# Altium schematic sheet [01] - LED DRIVER.SchDoc
size A
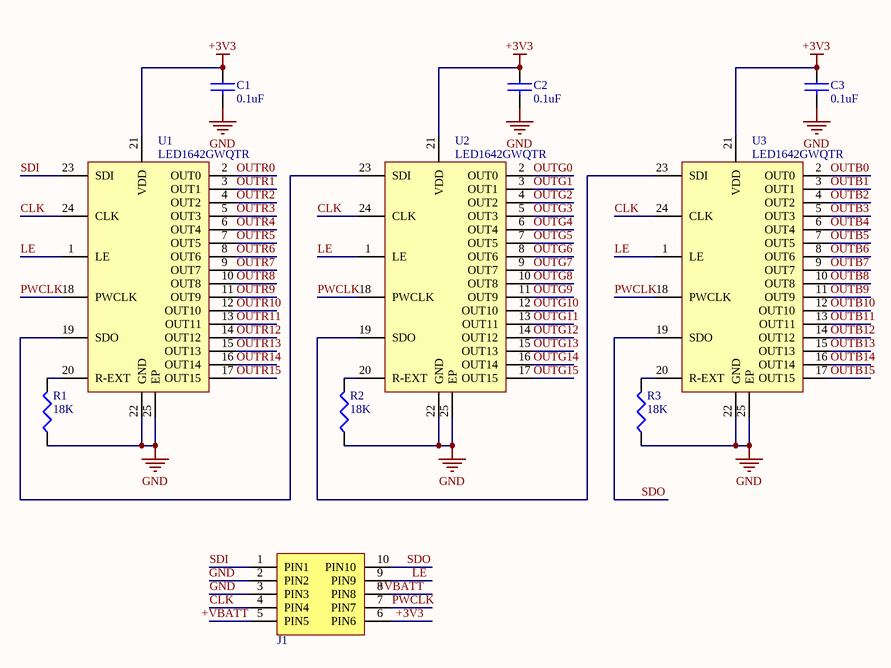
[diagram p0: [01] - LED DRIVER.SchDoc]

## Parts
C1  0.1uF  [C0402]
C2  0.1uF  [C0402]
C3  0.1uF  [C0402]
J1  20021121-00010C4LF  [20021121-00010C4LF]  (value not drawn)
R1  18K  [R0402]
R2  18K  [R0402]
R3  18K  [R0402]
U1  LED1642GWQTR  [QFN24]
U2  LED1642GWQTR  [QFN24]
U3  LED1642GWQTR  [QFN24]

## Nets
+3V3: C1.1 C2.1 C3.1 J1.6(PIN6) U1.21(VDD) U2.21(VDD) U3.21(VDD)
GND: C1.2 C2.2 C3.2 J1.2(PIN2) J1.3(PIN3) R1.1 R2.1 R3.1 U1.22(GND) U1.25(EP) U2.22(GND) U2.25(EP) U3.22(GND) U3.25(EP)
+VBATT: J1.5(PIN5) J1.8(PIN8)
CLK: J1.4(PIN4) U1.24(CLK) U2.24(CLK) U3.24(CLK)
LE: J1.9(PIN9) U1.1(LE) U2.1(LE) U3.1(LE)
OUTB0: U3.2(OUT0)
OUTB1: U3.3(OUT1)
OUTB2: U3.4(OUT2)
OUTB3: U3.5(OUT3)
OUTB4: U3.6(OUT4)
OUTB5: U3.7(OUT5)
OUTB6: U3.8(OUT6)
OUTB7: U3.9(OUT7)
OUTB8: U3.10(OUT8)
OUTB9: U3.11(OUT9)
OUTB10: U3.12(OUT10)
OUTB11: U3.13(OUT11)
OUTB12: U3.14(OUT12)
OUTB13: U3.15(OUT13)
OUTB14: U3.16(OUT14)
OUTB15: U3.17(OUT15)
OUTG0: U2.2(OUT0)
OUTG1: U2.3(OUT1)
OUTG2: U2.4(OUT2)
OUTG3: U2.5(OUT3)
OUTG4: U2.6(OUT4)
OUTG5: U2.7(OUT5)
OUTG6: U2.8(OUT6)
OUTG7: U2.9(OUT7)
OUTG8: U2.10(OUT8)
OUTG9: U2.11(OUT9)
OUTG10: U2.12(OUT10)
OUTG11: U2.13(OUT11)
OUTG12: U2.14(OUT12)
OUTG13: U2.15(OUT13)
OUTG14: U2.16(OUT14)
OUTG15: U2.17(OUT15)
OUTR0: U1.2(OUT0)
OUTR1: U1.3(OUT1)
OUTR2: U1.4(OUT2)
OUTR3: U1.5(OUT3)
OUTR4: U1.6(OUT4)
OUTR5: U1.7(OUT5)
OUTR6: U1.8(OUT6)
OUTR7: U1.9(OUT7)
OUTR8: U1.10(OUT8)
OUTR9: U1.11(OUT9)
OUTR10: U1.12(OUT10)
OUTR11: U1.13(OUT11)
OUTR12: U1.14(OUT12)
OUTR13: U1.15(OUT13)
OUTR14: U1.16(OUT14)
OUTR15: U1.17(OUT15)
PWCLK: J1.7(PIN7) U1.18(PWCLK) U2.18(PWCLK) U3.18(PWCLK)
SDI: J1.1(PIN1) U1.23(SDI)
SDO: J1.10(PIN10) U3.19(SDO)
NetR1_2: R1.2 U1.20(R-EXT)
NetR2_2: R2.2 U2.20(R-EXT)
NetR3_2: R3.2 U3.20(R-EXT)
NetU1_19: U1.19(SDO) U2.23(SDI)
NetU2_19: U2.19(SDO) U3.23(SDI)

## Library data of the parts
C1-C3 = CL05B104KO5NNNC: Cap Ceramic 0.1uF 16V X7R 10% SMD 0402 125C C/T; Manufacturer 1: Samsung; Description 1: Cap Ceramic 0.1uF 16V X7R 10% SMD 0402 125C Paper T/R; Capacitance: 100nF; Supplier 1: Digi-Key; Supplier Part Number 1: 1276-1001-6-ND; Manufacturer Part Number 1: CL05B104KO5NNNC; Stock 1: 9531; Pricing 1: 1=0.1, 10=0.018, 100=0.0081, 500=0.0058, 1000=0.0045, 2500=0.0041, 5000=0.0038 (USD); Mount: Surface Mount; Case/Package: 0402; Case Code (Metric): 1005; Case Code (Imperial): 0402; Material: Ceramic; Contact Plating: Tin; Min Operating Temperature: -55°C; Max Operating Temperature: 125°C; Tolerance: 10%; Package Quantity: 1; Packaging: Tape and Reel; Voltage Rating: 16V; Dielectric: X7R; Voltage: 16V; Voltage Rating (DC): 16V; Length: 1mm; Height: 0.5mm; Width: 0.02inch; Thickness: 0.022inch; Depth: 0.5mm; Radiation Hardening: No; Lead Free: Lead Free; ComponentLink1URL: https://datasheet.ciiva.com/16208/cl05b104kq5nnnc-16208343.pdf; ComponentLink1Description: https://datasheet.ciiva.com/16208/cl05b104kq5nnnc-16208343.pdf; ComponentLink2URL: https://datasheet.ciiva.com/26920/getdatasheetpartid-359683-26920169.pdf; ComponentLink2Description: https://datasheet.ciiva.com/26920/getdatasheetpartid-359683-26920169.pdf; ComponentLink3URL: https://datasheet.ciiva.com/26309/mlcc-catalogdownload2013-eng-26309003.pdf; ComponentLink3Description: https://datasheet.ciiva.com/26309/mlcc-catalogdownload2013-eng-26309003.pdf; ComponentLink4URL: https://datasheet.ciiva.com/29198/458718-da-01-en-vs-kondensator-0402-29198423.pdf; ComponentLink4Description: https://datasheet.ciiva.com/29198/458718-da-01-en-vs-kondensator-0402-29198423.pdf
J1 = 20021121-00010C4LF: CONN HEADER SMD 10POS 1.27MM; Manufacturer: Amphenol FCI; Number of Contacts: 10; Contact Resistance: 30mR; Current Rating: 1A; Voltage Rating: 125V; Insulation Resistance: 100MR; Gender: Male; Connector Type: Male Pin,Header; Row Spacing: 0.05inch; Stack Height: 3mm; Supplier 1: Digi-Key; Supplier Part Number 1: 609-3695-1-ND; Manufacturer Part Number: 20021121-00010C4LF; Stock 1: 79305; Pricing 1: 1=0.84, 10=0.739, 100=0.6372 (USD); Mount: Surface Mount; Contact Plating: Gold; Contact Material: Copper Alloy,Copper,Gold; Color: Black; Housing Color: Black; Housing Material: Thermoplastic; Min Operating Temperature: -40°C; Max Operating Temperature: 85°C; Number of Rows: 2; Termination: Solder; Packaging: Tape and Reel; Package Quantity: 600; Number of Positions: 10; Max Voltage Rating (AC): 125V; Orientation: Straight; Length: 6.35mm; Pitch: 1.27mm; Contact Mating Length: 0.12inch; Depth: 3.4mm; Radiation Hardening: No; REACH SVHC: No SVHC; ComponentLink1URL: https://www.verical.com/server-webapp/html/getDatasheet?partID=177140&src-supplier=Verical; ComponentLink1Description: https://www.verical.com/server-webapp/html/getDatasheet?partID=177140&src-supplier=Verical; ComponentLink2URL: http://portal.fciconnect.com/Comergent/fci/drawing/20021121.pdf?src-supplier=Avnet; ComponentLink2Description: http://portal.fciconnect.com/Comergent/fci/drawing/20021121.pdf?src-supplier=Avnet; ComponentLink3URL: https://cdn.amphenol-icc.com/media/wysiwyg/files/drawing/20021121.pdf?src-supplier=Digi-Key; ComponentLink3Description: https://cdn.amphenol-icc.com/media/wysiwyg/files/drawing/20021121.pdf?src-supplier=Digi-Key; ComponentLink4URL: http://portal.fciconnect.com/Comergent/fci/drawing/20021121.pdf?src-supplier=Avnet+Europe; ComponentLink4Description: http://portal.fciconnect.com/Comergent/fci/drawing/20021121.pdf?src-supplier=Avnet+Europe; ComponentLink5URL: https://media.digikey.com/pdf/Data%20Sheets/FCI%20PDFs/Minitek%20127_Catalog.pdf?src-supplier=Digi-Key; ComponentLink5Description: https://media.digikey.com/pdf/Data%20Sheets/FCI%20PDFs/Minitek%20127_Catalog.pdf?src-supplier=Digi-Key; ComponentLink6URL: http://portal.fciconnect.com/Comergent//fci/drawing/20021121.pdf?src-supplier=Mouser; ComponentLink6Description: http://portal.fciconnect.com/Comergent//fci/drawing/20021121.pdf?src-supplier=Mouser
R1-R3 = CRGCQ0402F18K: Manufacturer: TE Connectivity; Supplier 1: Digi-Key; Supplier Part Number 1: A129642CT-ND; Manufacturer Part Number: CRGCQ0402F18K; Stock 1: 128806; Pricing 1: 1=0.1, 10=0.022, 100=0.009, 1000=0.00406, 2500=0.00352, 5000=0.00291 (USD)
U1-U3 = LED1642GWQTR: IC LED DRIVER LIN DIM 40MA 24QFN; Manufacturer: STMicroelectronics; Number of Outputs: 16; Frequency: 30MHz; Output Current: 50mA; Max Supply Voltage: 5.5V; Min Supply Voltage: 3V; Nominal Supply Current: 10mA; Output Voltage: 19V; Operating Supply Voltage: 3.3V; Dimming: PWM; Supplier 1: Digi-Key; Supplier Part Number 1: 497-14029-1-ND; Manufacturer Part Number: LED1642GWQTR; Stock 1: 43999; Pricing 1: 1=2.1, 10=1.883, 100=1.5138, 500=1.24372, 1000=1.03052 (USD); Mount: Surface Mount; Case/Package: QFN; Number of Pins: 24; Min Operating Temperature: -40°C; Max Operating Temperature: 85°C; Package Quantity: 4000; Packaging: Tape and Reel; Min Input Voltage: 3V; Max Input Voltage: 5.5V; Max Output Current: 50mA; Number of Channels: 16; Output Current per Channel: 40mA; Max Supply Current: 10mA; Switching Frequency: 30MHz; Min Input Voltage (DC): 3V; Max Input Voltage (DC): 5.5V; Max Output Voltage: 19V; Nominal Input Voltage (DC): 3.3V; Length: 4.15mm; Height: 0.95mm; Width: 4.15mm; Radiation Hardening: No; REACH SVHC: No SVHC; Lead Free: Lead Free; ComponentLink1URL: http://www.st.com/content/ccc/resource/technical/document/datasheet/ae/9b/e2/7c/7d/66/41/08/DM00080246.pdf/files/DM00080246.pdf/jcr:content/translations/en.DM00080246.pdf?src-supplier=Digi-Key; ComponentLink1Description: http://www.st.com/content/ccc/resource/technical/document/datasheet/ae/9b/e2/7c/7d/66/41/08/DM00080246.pdf/files/DM00080246.pdf/jcr:content/translations/en.DM00080246.pdf?src-supplier=Digi-Key; ComponentLink2URL: https://www.verical.com/server-webapp/html/getDatasheet?partID=789956&src-supplier=Verical; ComponentLink2Description: https://www.verical.com/server-webapp/html/getDatasheet?partID=789956&src-supplier=Verical; ComponentLink3URL: http://www.st.com/web/en/resource/technical/document/datasheet/DM00080246.pdf?src-supplier=Avnet; ComponentLink3Description: http://www.st.com/web/en/resource/technical/document/datasheet/DM00080246.pdf?src-supplier=Avnet